# Altium schematic sheet sFMC98_v1.SchDoc
size A1
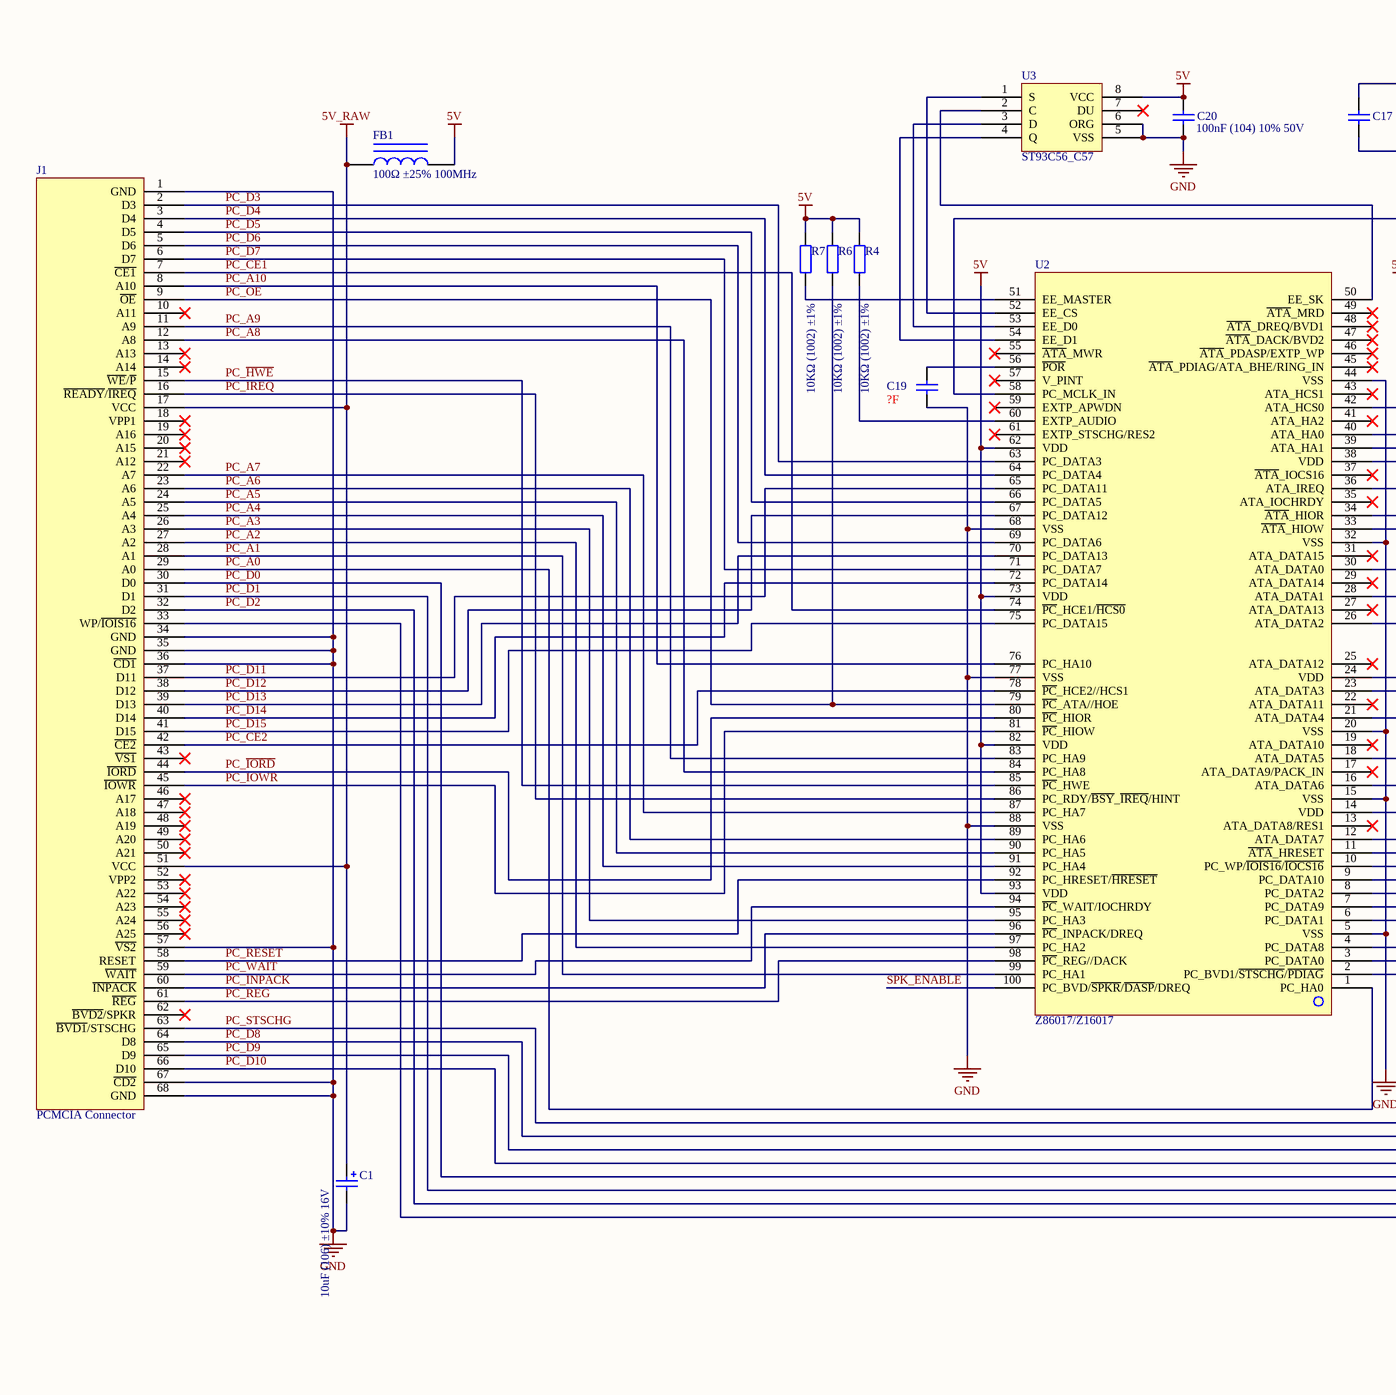
[diagram p0: sFMC98_v1.SchDoc, left]
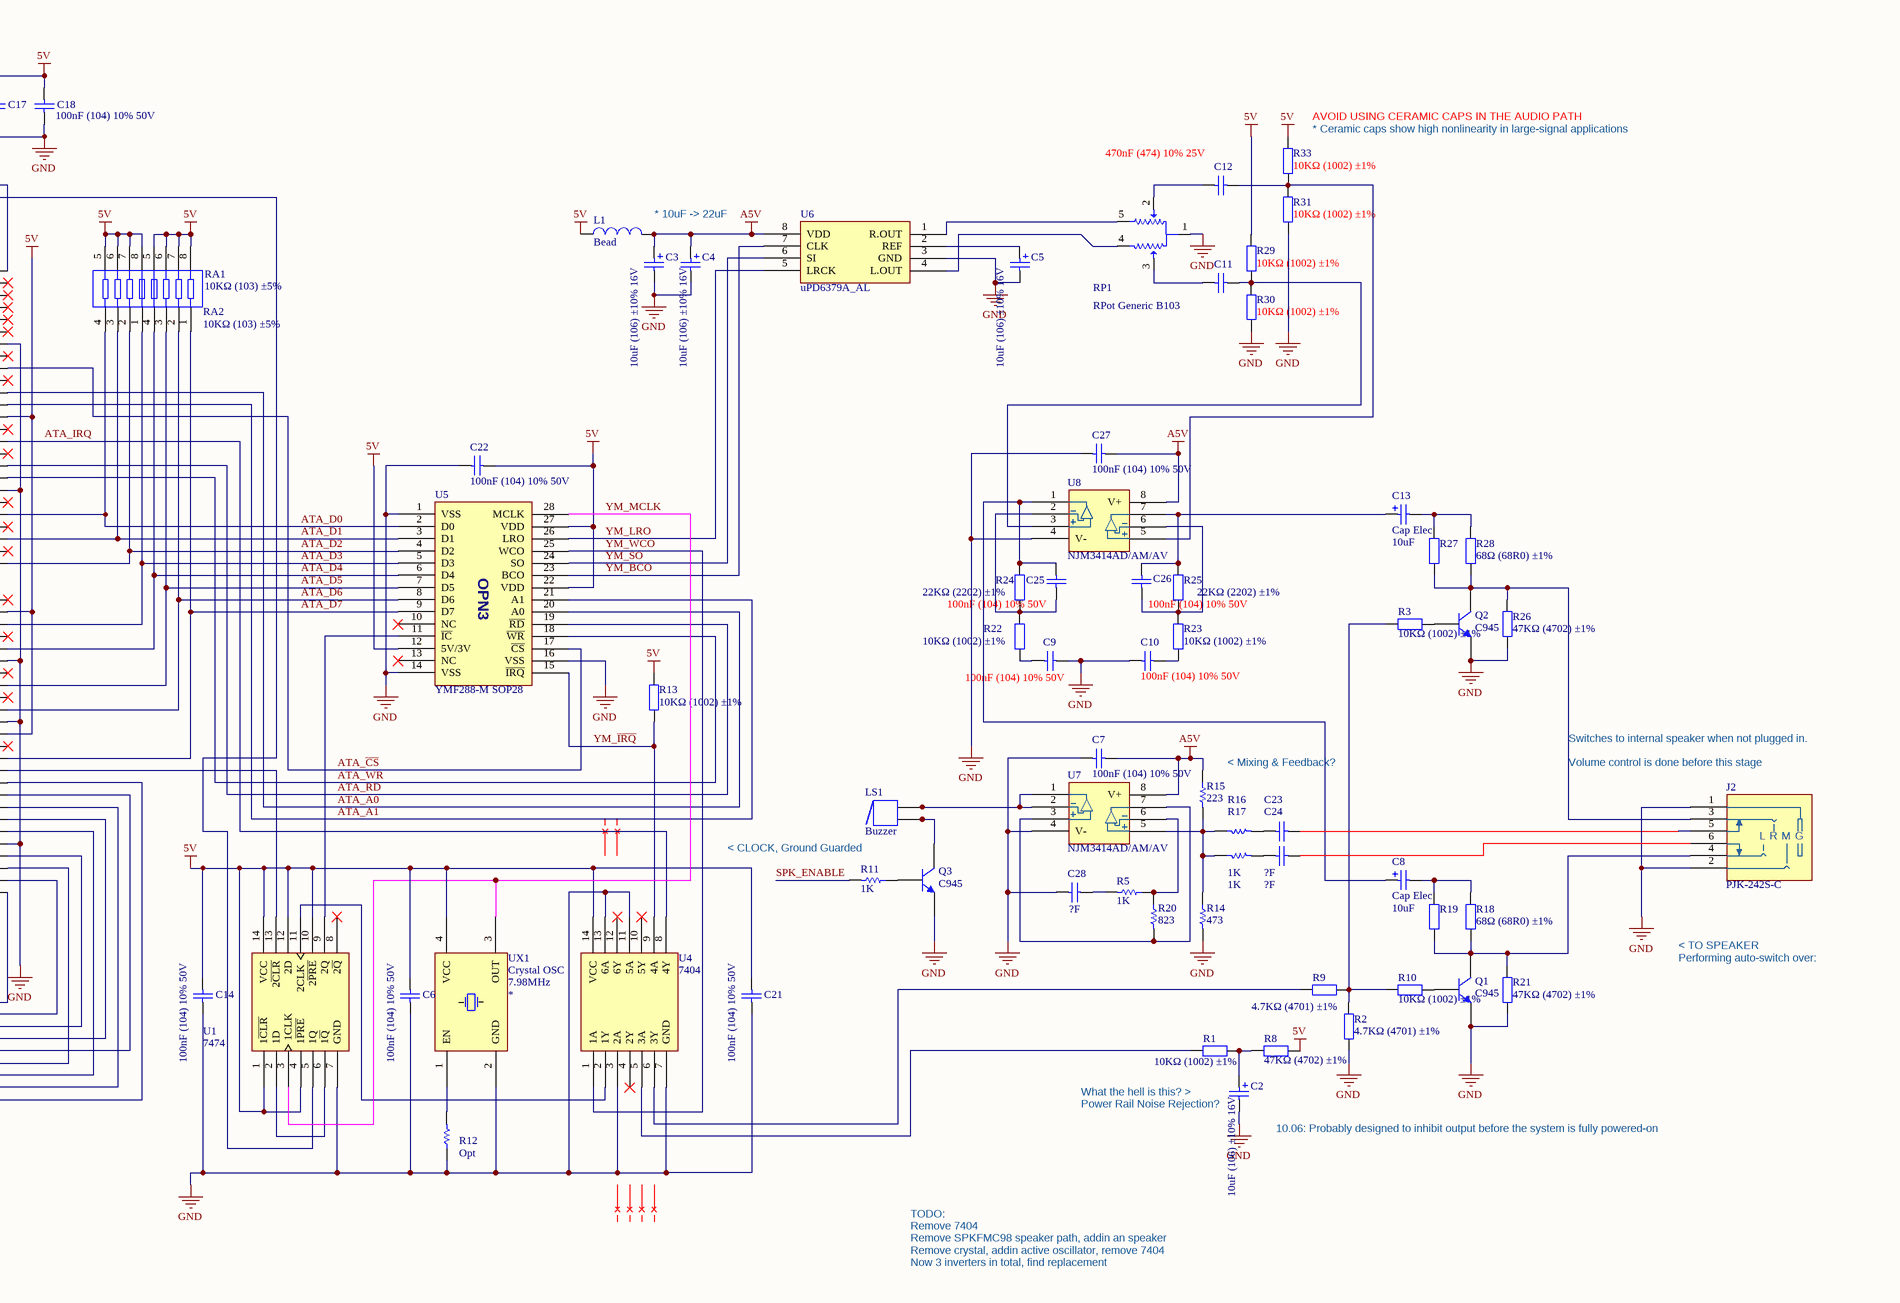
[diagram p1: sFMC98_v1.SchDoc, right]

## Parts
C1  10uF (106) ±10% 16V  [CASE-A_3216]
C2  10uF (106) ±10% 16V  [CASE-A_3216]
C3  10uF (106) ±10% 16V  [CASE-A_3216]
C4  10uF (106) ±10% 16V  [CASE-A_3216]
C5  10uF (106) ±10% 16V  [CASE-A_3216]
C6  100nF (104) 10% 50V  [0603_C]
C7  100nF (104) 10% 50V  [0603_C]
C8  Cap Elec  value 10uF  [C-RB-4_5MM_Cutout]
C9  100nF (104) 10% 50V  [0603_C]
C10  100nF (104) 10% 50V  [0603_C]
C11  470nF (474) 10% 25V  [0603_C]  (value not drawn)
C12  470nF (474) 10% 25V  [0603_C]
C13  Cap Elec  value 10uF  [C-RB-4_5MM_Cutout]
C14  100nF (104) 10% 50V  [0603_C]
C17  100nF (104) 10% 50V  [0603_C]  (value not drawn)
C18  100nF (104) 10% 50V  [0603_C]
C19  value ?F  [CEIA0603X04N]  (hidden comment: Cap)
C20  100nF (104) 10% 50V  [0603_C]
C21  100nF (104) 10% 50V  [0603_C]
C22  100nF (104) 10% 50V  [0603_C]
C23  value ?F  [CEIA0603X04N]  (hidden comment: Cap)
C24  value ?F  [CEIA0603X04N]  (hidden comment: Cap)
C25  100nF (104) 10% 50V  [0603_C]
C26  100nF (104) 10% 50V  [0603_C]
C27  100nF (104) 10% 50V  [0603_C]
C28  value ?F  [CEIA0603X04N]  (hidden comment: Cap)
FB1  100Ω ±25% 100MHz  [0805_L]
J1  PCMCIA Connector  [PCF-SMT-K1]
J2  PJK-242S-C  [PJK-242S-C]
L1  Bead  [L2012X10N_LQW21]
LS1  Buzzer  [SPK_PCB_MOUNT]
Q1  C945  [SOT-23(SOT-23-3)]
Q2  C945  [SOT-23(SOT-23-3)]
Q3  C945  [SOT-23(SOT-23-3)]
R1  10KΩ (1002) ±1%  [0603_R]
R2  4.7KΩ (4701) ±1%  [0603_R]
R3  10KΩ (1002) ±1%  [0603_R]
R4  10KΩ (1002) ±1%  [0603_R]
R5  value 1K  [REIA0603X04N]  (hidden comment: Res1)
R6  10KΩ (1002) ±1%  [0603_R]
R7  10KΩ (1002) ±1%  [0603_R]
R8  47KΩ (4702) ±1%  [0603_R]
R9  4.7KΩ (4701) ±1%  [0603_R]
R10  10KΩ (1002) ±1%  [0603_R]
R11  value 1K  [REIA0603X04N]  (hidden comment: Res1)
R12  value Opt  [REIA0603X04N]  (hidden comment: Res1)
R13  10KΩ (1002) ±1%  [0603_R]
R14  value 473  [REIA0603X04N]  (hidden comment: Res1)
R15  value 223  [REIA0603X04N]  (hidden comment: Res1)
R16  value 1K  [REIA0603X04N]  (hidden comment: Res1)
R17  value 1K  [REIA0603X04N]  (hidden comment: Res1)
R18  68Ω (68R0) ±1%  [0603_R]
R19  68Ω (68R0) ±1%  [0603_R]  (value not drawn)
R20  value 823  [REIA0603X04N]  (hidden comment: Res1)
R21  47KΩ (4702) ±1%  [0603_R]
R22  10KΩ (1002) ±1%  [0603_R]
R23  10KΩ (1002) ±1%  [0603_R]
R24  22KΩ (2202) ±1%  [0603_R]
R25  22KΩ (2202) ±1%  [0603_R]
R26  47KΩ (4702) ±1%  [0603_R]
R27  68Ω (68R0) ±1%  [0603_R]  (value not drawn)
R28  68Ω (68R0) ±1%  [0603_R]
R29  10KΩ (1002) ±1%  [0603_R]
R30  10KΩ (1002) ±1%  [0603_R]
R31  10KΩ (1002) ±1%  [0603_R]
R33  10KΩ (1002) ±1%  [0603_R]
RA1  10KΩ (103) ±5%  [0603_Rx4]
RA2  10KΩ (103) ±5%  [0603_Rx4]
RP1  RPot Generic B103  [RPot_RK10J12E_ALPS]
U1  7474  [TSSOP14_TSOP65P640X120-14N]
U2  Z86017/Z16017  [VQFP100_TSQFP50P1600X1600X160-100N]
U3  ST93C56_C57  [SOIC-8 NB]
U4  7404  [TSSOP14_TSOP65P640X120-14N]
U5  YMF288-M SOP28  [SOP127P1030X265-28N]
U6  uPD6379A_AL  [DMP8_SOIC127P680X175-8N]
U7  NJM3414AD/AM/AV  [DMP8_SOIC127P680X175-8N]
U8  NJM3414AD/AM/AV  [DMP8_SOIC127P680X175-8N]
UX1  Crystal OSC  Freq: 7.98MHz  [SMD-3225_4P]

## Nets
5V: C6.2 C14.2 C17.2 C18.2 C20.2 C21.2 C22.1 FB1.2 L1.2 R4.2 R6.2 R7.2 R8.1 R13.2 R29.2 R33.2 RA1.5 RA1.6 RA1.7 RA1.8 RA2.5 RA2.6 RA2.7 RA2.8 U1.1(1~{CLR}) U1.4(1~{PRE}) U1.10(2~{PRE}) U1.12(2D) U1.14(VCC) U2.14(VDD) U2.24(VDD) U2.38(VDD) U2.62(VDD) U2.73(VDD) U2.82(VDD) U2.93(VDD) U3.8(VCC) U4.14(VCC) U5.12(5V/3V) U5.22(VDD) U5.27(VDD) UX1.4(VCC)
5V_RAW: C1.1 FB1.1 J1.17(VCC) J1.51(VCC)
A5V: C3.1 C4.1 C7.1 C27.1 L1.1 R15.1 U6.8(VDD) U7.8(V+) U8.8(V+)
GND: C1.2 C2.2 C3.2 C4.2 C5.2 C6.1 C7.2 C9.2 C10.1 C14.1 C17.1 C18.1 C19.1 C20.1 C21.1 C22.2 C27.2 C28.1 J1.1(GND) J1.34(GND) J1.35(GND) J1.36(~{CD1}) J1.57(~{VS2}) J1.67(~{CD2}) J1.68(GND) J2.1 J2.2 Q1.2(E) Q2.2(E) Q3.2(E) R2.1 R12.1 R14.2 R21.1 R26.1 R30.1 R31.1 RP1.1 U1.7(GND) U2.5(VSS) U2.15(VSS) U2.20(VSS) U2.32(VSS) U2.44(VSS) U2.68(VSS) U2.77(VSS) U2.88(VSS) U3.5(VSS) U3.6(ORG) U4.3(2A) U4.7(GND) U4.11(5A) U4.13(6A) U5.1(VSS) U5.14(VSS) U5.16(VSS) U6.3(GND) U7.4(V-) U8.4(V-) UX1.2(GND)
ATA_A0: U2.40(ATA_HA0) U5.20(A0)
ATA_A1: U2.39(ATA_HA1) U5.21(A1)
ATA_~{CS}: U2.42(ATA_HCS0) U5.17(~{CS})
ATA_D0: RA2.4 U2.30(ATA_DATA0) U5.2(D0)
ATA_D1: RA2.3 U2.28(ATA_DATA1) U5.3(D1)
ATA_D2: RA2.2 U2.26(ATA_DATA2) U5.4(D2)
ATA_D3: RA2.1 U2.23(ATA_DATA3) U5.5(D3)
ATA_D4: RA1.4 U2.21(ATA_DATA4) U5.6(D4)
ATA_D5: RA1.3 U2.18(ATA_DATA5) U5.7(D5)
ATA_D6: RA1.2 U2.16(ATA_DATA6) U5.8(D6)
ATA_D7: RA1.1 U2.12(ATA_DATA7) U5.9(D7)
ATA_IRQ: U2.36(ATA_IREQ) U4.8(4Y)
ATA_~{RD}: U2.34(~{ATA}_HIOR) U5.19(~{RD})
ATA_~{WR}: U2.33(~{ATA}_HIOW) U5.18(~{WR})
PC_A0: J1.29(A0) U2.1(PC_HA0)
PC_A1: J1.28(A1) U2.99(PC_HA1)
PC_A2: J1.27(A2) U2.97(PC_HA2)
PC_A3: J1.26(A3) U2.95(PC_HA3)
PC_A4: J1.25(A4) U2.91(PC_HA4)
PC_A5: J1.24(A5) U2.90(PC_HA5)
PC_A6: J1.23(A6) U2.89(PC_HA6)
PC_A7: J1.22(A7) U2.87(PC_HA7)
PC_A8: J1.12(A8) U2.84(PC_HA8)
PC_A9: J1.11(A9) U2.83(PC_HA9)
PC_A10: J1.8(A10) U2.76(PC_HA10)
PC_~{CE1}: J1.7(~{CE1}) U2.74(~{PC}_HCE1/~{HCS0})
PC_~{CE2}: J1.42(~{CE2}) U2.78(~{PC}_HCE2//HCS1)
PC_D0: J1.30(D0) U2.3(PC_DATA0)
PC_D1: J1.31(D1) U2.6(PC_DATA1)
PC_D2: J1.32(D2) U2.8(PC_DATA2)
PC_D3: J1.2(D3) U2.63(PC_DATA3)
PC_D4: J1.3(D4) U2.64(PC_DATA4)
PC_D5: J1.4(D5) U2.66(PC_DATA5)
PC_D6: J1.5(D6) U2.69(PC_DATA6)
PC_D7: J1.6(D7) U2.71(PC_DATA7)
PC_D8: J1.64(D8) U2.4(PC_DATA8)
PC_D9: J1.65(D9) U2.7(PC_DATA9)
PC_D10: J1.66(D10) U2.9(PC_DATA10)
PC_D11: J1.37(D11) U2.65(PC_DATA11)
PC_D12: J1.38(D12) U2.67(PC_DATA12)
PC_D13: J1.39(D13) U2.70(PC_DATA13)
PC_D14: J1.40(D14) U2.72(PC_DATA14)
PC_D15: J1.41(D15) U2.75(PC_DATA15)
PC_~{HWE}: J1.15(~{WE}/~{P}) U2.85(~{PC}_HWE)
PC_~{INPACK}: J1.60(~{INPACK}) U2.96(~{PC}_INPACK/DREQ)
PC_~{IORD}: J1.44(~{IORD}) U2.80(~{PC}_HIOR)
PC_~{IOWR}: J1.45(~{IOWR}) U2.81(~{PC}_HIOW)
PC_~{IREQ}: J1.16(~{READY}/~{IREQ}) U2.86(PC_RDY/~{BSY}_~{IREQ}/HINT)
PC_~{OE}: J1.9(~{OE}) R6.1 U2.79(~{PC}_ATA//HOE)
PC_~{REG}: J1.61(~{REG}) U2.98(~{PC}_REG//DACK)
PC_RESET: J1.58(RESET) U2.92(PC_HRESET/~{HRESET})
PC_STSCHG: J1.63(~{BVD1}/STSCHG) U2.2(PC_BVD1/~{STSCHG}/~{PDIAG})
PC_~{WAIT}: J1.59(~{WAIT}) U2.94(~{PC}_WAIT/IOCHRDY)
SPK_ENABLE: R11.2 U2.100(PC_BVD/~{SPKR}/~{DASP}/DREQ)
YM_BCO: U5.23(BCO) U6.7(CLK)
YM_~{IRQ}: R13.1 U4.9(4A) U5.15(~{IRQ})
YM_LRO: U5.26(LRO) U6.5(LRCK)
YM_MCLK: U1.3(1CLK) U5.28(MCLK) UX1.3(OUT)
YM_SO: U5.24(SO) U6.6(SI)
YM_WCO: U4.1(1A) U5.25(WCO)
NetC2_1: C2.1 R1.1 R8.2
NetC5_1: C5.1 U6.2(REF)
NetC8_1: C8.1 C25.1 R24.2 U8.1
NetC8_2: C8.2 R18.2 R19.2
NetC9_1: C9.1 R22.1
NetC10_2: C10.2 R23.1
NetC11_1: C11.1 RP1.3
NetC11_2: C11.2 R29.1 R30.2 U8.3
NetC12_1: C12.1 RP1.2
NetC12_2: C12.2 R31.2 R33.1 U8.5
NetC13_1: C13.1 C26.1 R25.2 U8.7
NetC13_2: C13.2 R27.2 R28.2
NetC19_2: C19.2 U2.56(~{POR})
NetC23_1: C23.1 J2.5
NetC23_2: C23.2 R16.2
NetC24_1: C24.1 J2.6
NetC24_2: C24.2 R17.2
NetC25_2: C25.2 R22.2 R24.1 U8.2
NetC26_2: C26.2 R23.2 R25.1 U8.6
NetC28_2: C28.2 R5.2
NetJ1_33: J1.33(WP/~{IOIS16}) U2.10(PC_WP/~{IOIS16}/~{IOCS16})
NetJ2_3: J2.3 Q2.3(C) R26.2 R27.1 R28.1
NetJ2_4: J2.4 Q1.3(C) R18.1 R19.1 R21.2
NetLS1_1: LS1.1 LS1.1A U7.1 U7.2
NetLS1_2: LS1.2 LS1.2A Q3.3(C)
NetQ1_1: Q1.1(B) R10.1
NetQ2_1: Q2.1(B) R3.1
NetQ3_1: Q3.1(B) R11.1
NetR1_2: R1.2 U4.5(3A)
NetR2_2: R2.2 R3.2 R9.2 R10.2
NetR4_1: R4.1 U2.60(EXTP_AUDIO)
NetR5_1: R5.1 R20.1 U7.6
NetR7_1: R7.1 U2.51(EE_MASTER)
NetR9_1: R9.1 U4.6(3Y)
NetR12_2: R12.2 UX1.1(EN)
NetR14_1: R14.1 R15.2 R16.1 R17.1 U7.5
NetR20_2: R20.2 U7.3 U7.7
NetRP1_4: RP1.4 U6.4(L.OUT)
NetRP1_5: RP1.5 U6.1(R.OUT)
NetU1_2: U1.2(1D) U1.6(1~{Q})
NetU1_5: U1.5(1Q) U2.58(PC_MCLK_IN)
NetU1_9: U1.9(2Q) U5.11(~{IC})
NetU1_11: U1.11(2CLK) U4.2(1Y)
NetU1_13: U1.13(2~{CLR}) U2.11(~{ATA}_HRESET)
NetU2_50: U2.50(EE_SK) U3.2(C)
NetU2_52: U2.52(EE_CS) U3.1(S)
NetU2_53: U2.53(EE_D0) U3.3(D)
NetU2_54: U2.54(EE_D1) U3.4(Q)

Not connected (* = marked no-connect by the designer): J1 10(A11)* 13(A13)* 14(A14)* 18(VPP1)* 19(A16)* 20(A15)* 21(A12)* 43(~{VS1})* 46(A17)* 47(A18)* 48(A19)* 49(A20)* 50(A21)* 52(VPP2)* 53(A22)* 54(A23)* 55(A24)* 56(A25)* 62(~{BVD2}/SPKR)*; U1 8(2~{Q})*; U2 13(ATA_DATA8/RES1)* 17(ATA_DATA9/PACK_IN)* 19(ATA_DATA10)* 22(ATA_DATA11)* 25(ATA_DATA12)* 27(ATA_DATA13)* 29(ATA_DATA14)* 31(ATA_DATA15)* 35(ATA_IOCHRDY)* 37(~{ATA}_IOCS16)* 41(ATA_HA2)* 43(ATA_HCS1)* 45(~{ATA}_PDIAG/ATA_BHE/RING_IN)* 46(~{ATA}_PDASP/EXTP_WP)* 47(~{ATA}_DACK/BVD2)* 48(~{ATA}_DREQ/BVD1)* 49(~{ATA}_MRD)* 55(~{ATA}_MWR)* 57(V_PINT)* 59(EXTP_APWDN)* 61(EXTP_STSCHG/RES2)*; U3 7(DU)*; U4 4(2Y)* 10(5Y)* 12(6Y)*; U5 10(NC)* 13(NC)*

## Notes on the sheet
- (near R33) AVOID USING CERAMIC CAPS IN THE AUDIO PATH
- (near R33) * Ceramic caps show high nonlinearity in large-signal applications
- (near L1) * 10uF -> 22uF
- Switches to internal speaker when not plugged in.
- (near R15) < Mixing & Feedback?
- (near J2) Volume control is done before this stage
- (near R11) < CLOCK, Ground Guarded
- < TO SPEAKER
- Performing auto-switch over:
- What the hell is this? >
- (near C2) Power Rail Noise Rejection?
- (near C2) 10.06: Probably designed to inhibit output before the system is fully powered-on
- TODO:
- Remove 7404
- Remove SPKFMC98 speaker path, addin an speaker
- Remove crystal, addin active oscillator, remove 7404
- Now 3 inverters in total, find replacement
- (in symbol PJK-242S-C) L; R; M; G
- (in symbol YMF288_M) OPN3

## Library data of the parts
C1-C5 = 3216 10uF (106) 10% 16V: 钽电容; ComponentLink1Description: 供应商链接; ComponentLink1URL: http://www.szlcsc.com/product/details_7643.html; Package: 3216; Supplier: LC; SuppliersPartNumber: C7171
C6 C7 C9 C10 C14 C17 C18 C20-C22 C25-C27 = 0603 100nF (104) 10% 50V: 贴片电容; ComponentLink1Description: 供应商链接; ComponentLink1URL: http://www.szlcsc.com/product/details_15331.html; Package: 0603; Supplier: LC; SuppliersPartNumber: C14663
C8 C13 = Cap Pol3: Polarized Capacitor (Surface Mount); Published: 8-Jun-2000; LatestRevisionDate: 29-May-2009; LatestRevisionNote: IPC-7351 Footprint Added.; PackageReference: C0805; Publisher: Altium Limited; PackageDescription: Chip Capacitor
C11 C12 = 0603 470nF (474) 10% 25V: 贴片电容; ComponentLink1Description: 供应商链接; ComponentLink1URL: http://www.szlcsc.com/product/details_1975.html; Package: 0603; Supplier: LC; SuppliersPartNumber: C1623
C19 C23 C24 C28 = Cap: Capacitor; Published: 8-Jun-2000; LatestRevisionDate: 17-Jul-2002; LatestRevisionNote: Re-released for DXP Platform.; PackageReference: RAD-0.3; Publisher: Altium Limited; PackageDescription: Radial Cap, Thru-Hole; 2 Leads; 0.3 in Pin Spacing
FB1 = 0805 100Ω 25% 100MHz: 贴片磁珠; ComponentLink1Description: 供应商链接; ComponentLink1URL: http://www.szlcsc.com/product/details_1367.html; Package: 0805; Supplier: LC; SuppliersPartNumber: C1015
J1 = PCMCIA_Conn
J2 = PJK-242S-C: 2.5mm Headphone Jack
L1 = Inductor: Code_IEC: 1005; Value: 1; Published: 8-Jun-2000; LatestRevisionDate: 29-May-2009; LatestRevisionNote: IPC-7351 Footprint Added.; PackageReference: 0402-A; Publisher: Altium Limited; PackageDescription: Chip Inductor; Code_JEITA: 0402
LS1 = Buzzer: Magnetic Transducer Buzzer; Published: 24-Mar-1999; LatestRevisionDate: 17-Dec-2003; LatestRevisionNote: Schematic revised, PCB Footprint replaced.; DatasheetVersion: 17-Dec-2003; PackageReference: ABSM-1574; Publisher: Altium Limited; PackageDescription: Magnetic Transducer Buzzer; ComponentLink1Description: Manufacturer Link; ComponentLink1URL: http://www.megastar.com/linecard/buzzmode/index.php
Q1-Q3 = SOT-23 SS8050 Y1: 三极管; ComponentLink1Description: 供应商链接; ComponentLink1URL: http://www.szlcsc.com/product/details_2507.html; Package: SOT-23; Supplier: LC; SuppliersPartNumber: C2150
R1 R3 R4 R6 R7 R10 R13 R22 R23 R29-R31 R33 = 0603 10KΩ (1002) 1%: 贴片电阻; ComponentLink1Description: 供应商链接; ComponentLink1URL: http://www.szlcsc.com/product/details_26547.html; Package: 0603; Supplier: LC; SuppliersPartNumber: C25804
R2 R9 = 0603 4.7KΩ (4701) 1%: 贴片电阻; ComponentLink1Description: 供应商链接; ComponentLink1URL: http://www.szlcsc.com/product/details_23889.html; Package: 0603; Supplier: LC; SuppliersPartNumber: C23162
R5 R11 R12 R14-R17 R20 = Res1: Resistor; Published: 8-Jun-2000; LatestRevisionDate: 17-Jul-2002; LatestRevisionNote: Re-released for DXP Platform.; PackageReference: AXIAL-0.3; Publisher: Altium Limited; PackageDescription: Axial Device, Thru-Hole; 2 Leads; 0.3 in Pin Spacing
R8 R21 R26 = 0603 47KΩ (4702) 1%: 贴片电阻; ComponentLink1Description: 供应商链接; ComponentLink1URL: http://www.szlcsc.com/product/details_26562.html; Package: 0603; Supplier: LC; SuppliersPartNumber: C25819
R18 R19 R27 R28 = 0603 68Ω (68R0) 1%: 贴片电阻; ComponentLink1Description: 供应商链接; ComponentLink1URL: http://www.szlcsc.com/product/details_28341.html; Package: 0603; Supplier: LC; SuppliersPartNumber: C27592
R24 R25 = 0603 22KΩ (2202) 1%: 贴片电阻; ComponentLink1Description: 供应商链接; ComponentLink1URL: http://www.szlcsc.com/product/details_32812.html; Package: 0603; Supplier: LC; SuppliersPartNumber: C31850
RA1 RA2 = 0603*4  10KΩ (103) 5%: 贴片排阻; ComponentLink1Description: 供应商链接; ComponentLink1URL: http://www.szlcsc.com/product/details_30472.html; Package: 0603*4; Supplier: LC; SuppliersPartNumber: C29718
RP1 = RPot_Generic_Bxxx
U1 = 7474_J_N_1: Dual D-Type Positive-Edge-Triggered Flip-Flops With Preset And Clear
U2 = ZX6017
U3 = ST93C56_C57: 2K (128 x 16 or 256 x 8) SERIAL MICROWIRE EEPROM
U4 = 7404_J_N_1: Hex Inverter
U5 = YMF288_M
U6 = uPD6379A_AL: 2-CHANNEL 16-BIT D/A CONVERTER FOR AUDIO APPLICATION
U7 U8 = NJM3414AD_AM_AV_1: Single-Supply Dual High Current Operational Amplifier
UX1 = XTAL_OSC: Type: *